# EAGLE design Schematic (EAGLE 9.5.2)
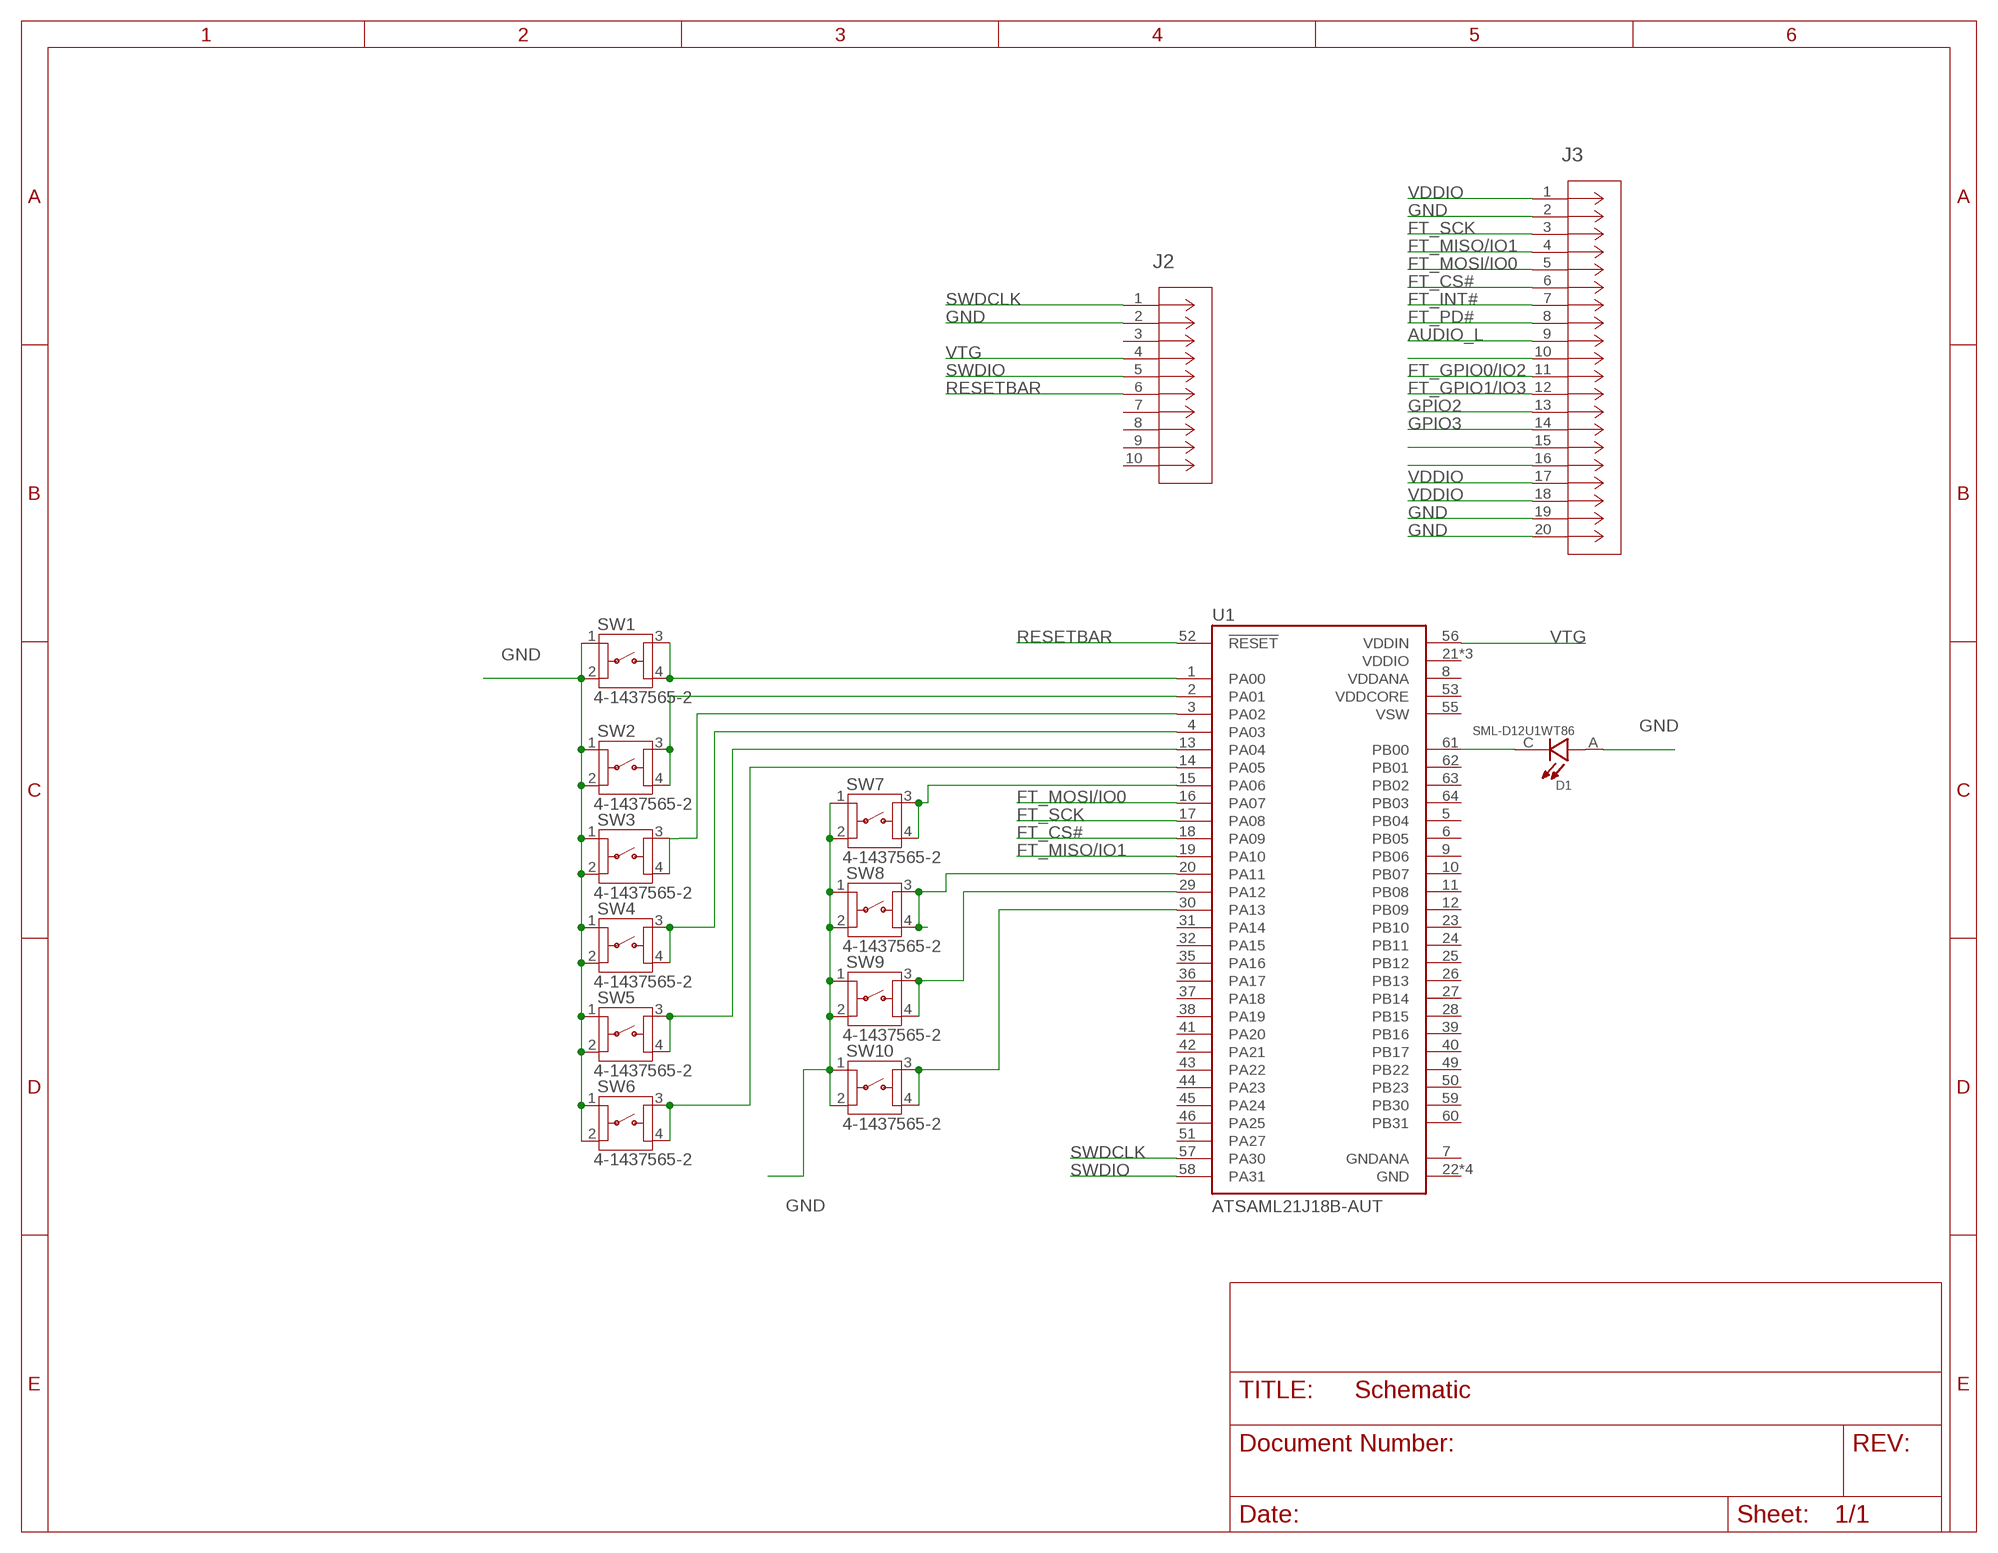
[diagram p0: schematic, sheet 1]

## Parts
D1  SML-D12U1WT86  [LED_SML-D12Y1WT86]
J2  20021121-00010C4LF  [CONN_00010C4LF_AMP]
J3  SBH11-NBPC-D10-SM-BK  [CONN_SBH11-NBPC-D10-SM-BK]
SW1  4-1437565-2  [SW_4-1437565-2]
SW2  4-1437565-2  [SW_4-1437565-2]
SW3  4-1437565-2  [SW_4-1437565-2]
SW4  4-1437565-2  [SW_4-1437565-2]
SW5  4-1437565-2  [SW_4-1437565-2]
SW6  4-1437565-2  [SW_4-1437565-2]
SW7  4-1437565-2  [SW_4-1437565-2]
SW8  4-1437565-2  [SW_4-1437565-2]
SW9  4-1437565-2  [SW_4-1437565-2]
SW10  4-1437565-2  [SW_4-1437565-2]
U1  ATSAML21J18B-AUT  [QFP50P1200X1200X120-64N]

## Nets
AUDIO_L: J3.9
FT_CS#: J3.6 U1.18(PA09)
FT_GPIO0/IO2: J3.11
FT_GPIO1/IO3: J3.12
FT_INT#: J3.7
FT_MISO/IO1: J3.4 U1.19(PA10)
FT_MOSI/IO0: J3.5 U1.16(PA07)
FT_PD#: J3.8
FT_SCK: J3.3 U1.17(PA08)
GND: D1.A J2.2 J3.2 J3.19 J3.20 SW1.1 SW1.2 SW2.1 SW2.2 SW3.1 SW3.2 SW4.1 SW4.2 SW5.1 SW5.2 SW6.1 SW6.2 SW7.1 SW7.2 SW8.1 SW8.2 SW9.1 SW9.2 SW10.1 SW10.2
GPIO2: J3.13
GPIO3: J3.14
N$1: SW1.3 SW1.4 U1.1(PA00)
N$2: SW2.3 SW2.4 U1.2(PA01)
N$3: SW3.3 SW3.4 U1.3(PA02)
N$4: SW4.3 SW4.4 U1.4(PA03)
N$5: SW5.3 SW5.4 U1.13(PA04)
N$6: SW6.3 SW6.4 U1.14(PA05)
N$7: SW7.3 SW7.4 U1.15(PA06)
N$8: SW8.3 SW8.4 U1.20(PA11)
N$9: SW9.3 SW9.4 U1.29(PA12)
N$10: SW10.3 SW10.4 U1.30(PA13)
N$15: D1.C U1.61(PB00)
N$22: J3.10
N$27: J3.15
N$28: J3.16
RESETBAR: J2.6 U1.52(!RESET)
SWDCLK: J2.1 U1.57(PA30)
SWDIO: J2.5 U1.58(PA31)
VDDIO: J3.1 J3.17 J3.18
VTG: J2.4 U1.56(VDDIN)
Unconnected: J2.3 J2.7 J2.8 J2.9 J2.10 U1.5(PB04) U1.6(PB05) U1.9(PB06) U1.10(PB07) U1.11(PB08) U1.12(PB09) U1.23(PB10) U1.24(PB11) U1.25(PB12) U1.26(PB13) U1.27(PB14) U1.28(PB15) U1.31(PA14) U1.32(PA15) U1.35(PA16) U1.36(PA17) U1.37(PA18) U1.38(PA19) U1.39(PB16) U1.40(PB17) U1.41(PA20) U1.42(PA21) U1.43(PA22) U1.44(PA23) U1.45(PA24) U1.46(PA25) U1.49(PB22) U1.50(PB23) U1.51(PA27) U1.59(PB30) U1.60(PB31) U1.62(PB01) U1.63(PB02) U1.64(PB03)

## Power pins joined to a net without a drawn wire
GND: U1.22(GND) U1.33(GND) U1.47(GND) U1.54(GND)
GNDANA: U1.7(GNDANA)
VDDANA: U1.8(VDDANA)
VDDCORE: U1.53(VDDCORE)
VDDIO: U1.21(VDDIO) U1.34(VDDIO) U1.48(VDDIO)
VSW: U1.55(VSW)

## Library data of the parts
D1 = SML-D12U1WT86:SML-D12U1WT86: RED CHIP LED MINI-MOLD; DESCRIPTION: Red 620nm LED Indication - Discrete 2.2V 0603 _1608 Metric_; DIGI-KEY_PART_NUMBER: SML-D12U1WT86CT-ND; DIGI-KEY_PURCHASE_URL: https://www.digikey.com/product-detail/en/rohm-semiconductor/SML-D12U1WT86/SML-D12U1WT86CT-ND/5843858?utm_source=snapeda&utm_medium=aggregator&utm_campaign=symbol; MF: Rohm; MP: SML-D12U1WT86; PACKAGE: 0603 Rohm
J2 = ESE 323 Custom Library:20021121-00010C4LF; BUILT_BY: EMA_Matt; COPYRIGHT: Copyright (C) 2018 Accelerated Designs. All rights reserved; MANUFACTURER_PART_NUMBER: 20021121-00010C4LF; SOURCELIBRARY: Amphenol_2019-10-30; VENDOR: Amphenol
J3 = ESE 323 Custom Library:SBH11-NBPC-D10-SM-BK; BUILT_BY: EMA_Cory; COPYRIGHT: Copyright (C) 2018 Accelerated Designs. All rights reserved; MANUFACTURER_PART_NUMBER: SBH11-NBPC-D10-SM-BK; VENDOR: Sullins
SW1-SW10 = 4-1437565-2:4-1437565-2: Switch Tactile OFF (ON) SPST Round Button Gull Wing 0.05A 12VDC 1.57N SMD T/R; COMMENT: 4-1437565-2; DESCRIPTION: Switch Tactile OFF _ON_ SPST Round Button Gull Wing 0.05A 24VDC 1VA 9.18N SMD T/R; DIGI-KEY_PART_NUMBER: 450-1759-1-ND; DIGI-KEY_PURCHASE_URL: https://www.digikey.com/product-detail/en/te-connectivity-alcoswitch-switches/FSM4JSMATR/450-1759-1-ND/2271638?utm_source=snapeda&utm_medium=aggregator&utm_campaign=symbol; MF: TE Connectivity; MP: FSM4JSMATR; PACKAGE: None; TE_PURCHASE_URL: https://www.te.com/usa-en/product-4-1437565-2.html?te_bu=Cor&te_type=disp&te_campaign=seda_glo_cor-seda-global-disp-prtnr-fy19-seda-model-bom-cta_sma-317_1&elqCampaignId=32493
U1 = ATSAML21J18B-AUT:ATSAML21J18B-AUT: Cortex-MO+, 256KBFLASH, 32 KBSRAM, USB, ULP - 64TQFP 85C, GREEN, 1.6-3.6V, 48MHz/ TQFP (A); DESCRIPTION: ARM® Cortex®-M0+ SAM L21J Microcontroller IC 32-Bit 48MHz 256KB _256K x 8_ FLASH 64-TQFP _10x10_; DIGI-KEY_PART_NUMBER: ATSAML21J18B-AUTCT-ND; DIGI-KEY_PURCHASE_URL: https://www.digikey.com/product-detail/en/microchip-technology/ATSAML21J18B-AUT/ATSAML21J18B-AUTCT-ND/5702316?utm_source=snapeda&utm_medium=aggregator&utm_campaign=symbol; MF: Microchip; MP: ATSAML21J18B-AUT; PACKAGE: TQFP-64 Microchip

## Board
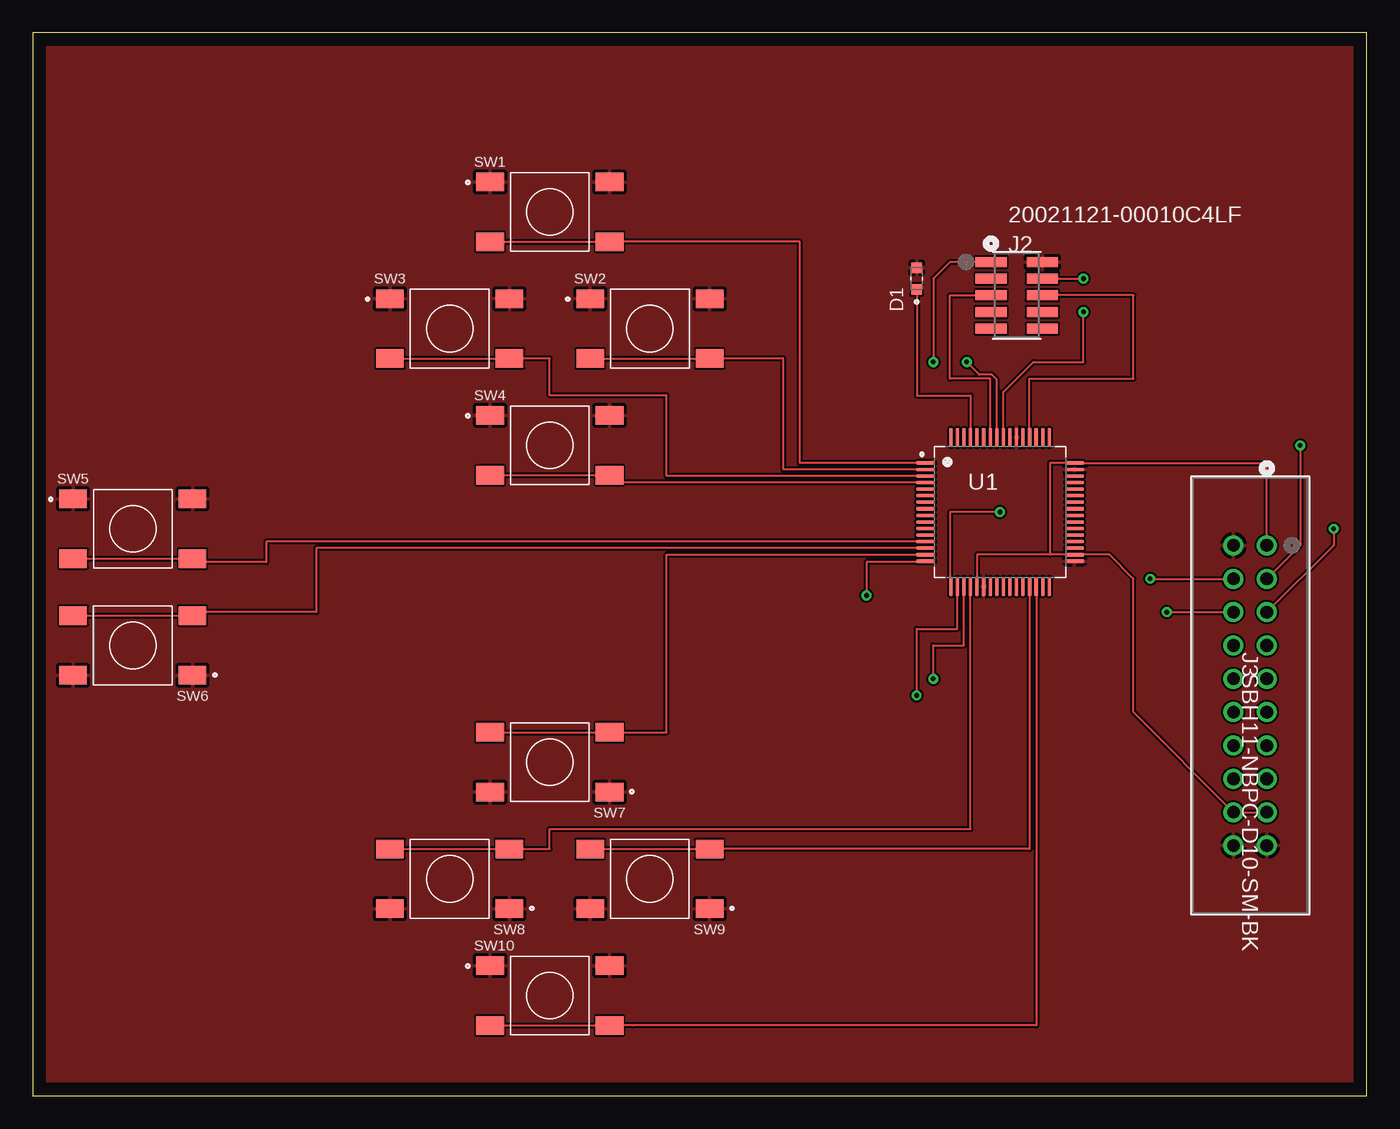
[diagram p1: board, top side]
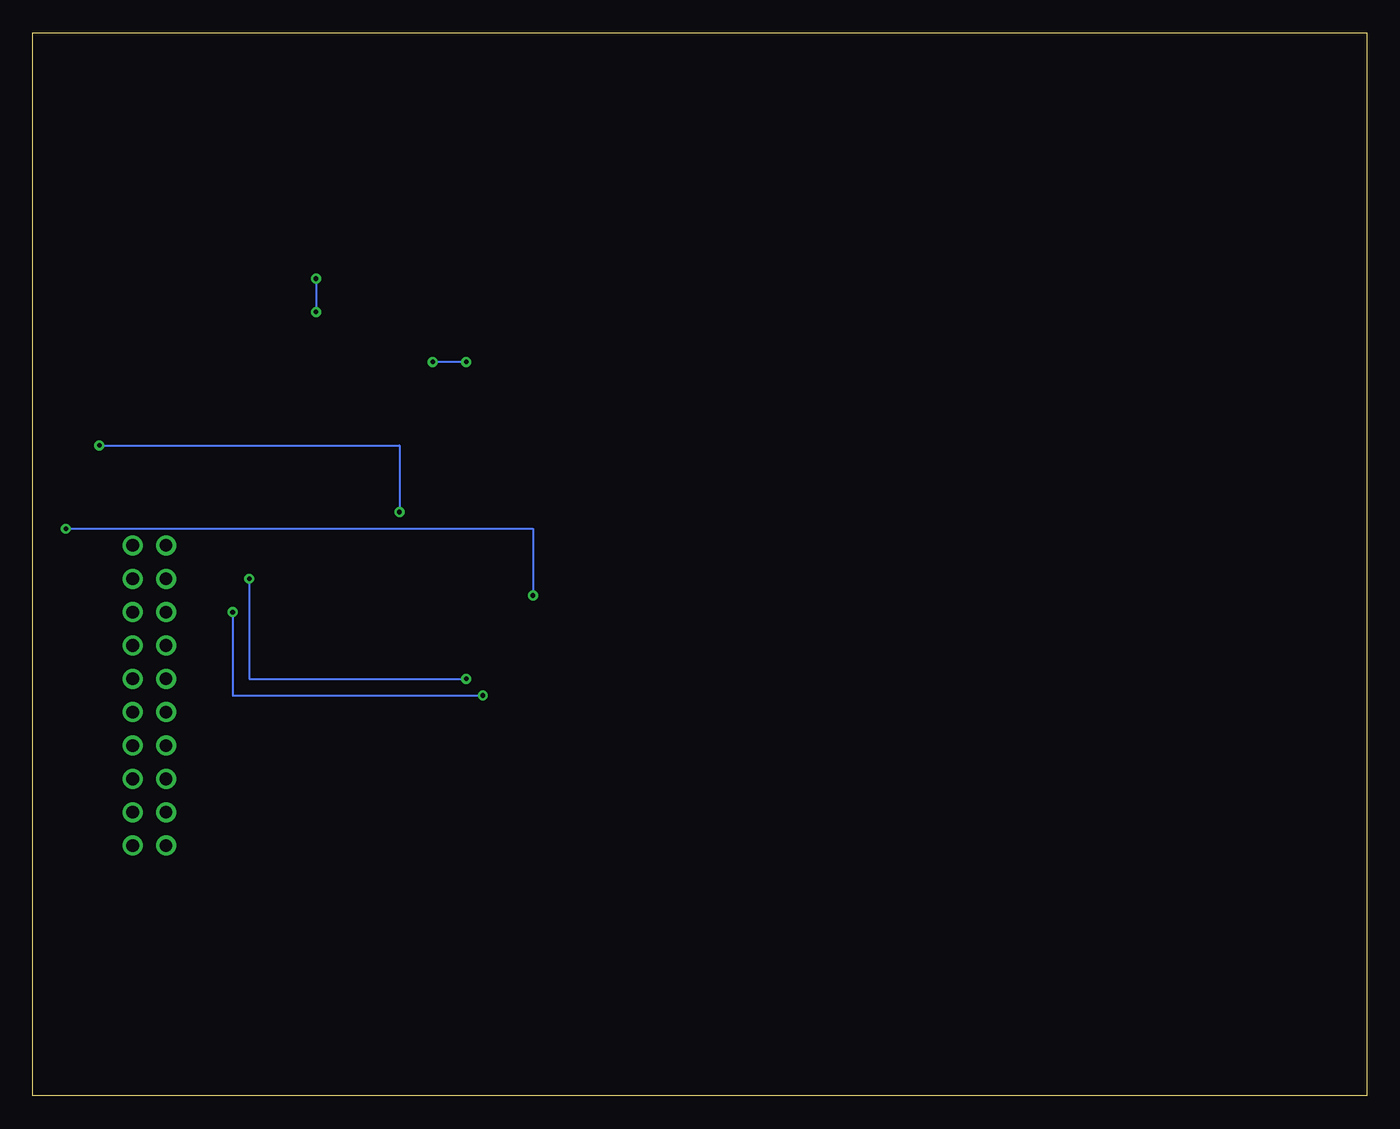
[diagram p2: board, bottom side, seen from below]

Size 101.58 x 80.95 mm. Coordinates in mm from the lower left corner, seen from the top.
Outline: 0,0 101.58,0 101.58,80.95 0,80.95 0,0
Copper layers (1*16): Top 0.035mm / dielectric 1.5mm / Bottom 0.035mm
Design rules "default": minimum track width 6mil, minimum drill 0.35mm, track to track 6mil, track to pad 6mil, pad to pad 6mil, via to via 6mil, smd to smd 6mil, copper to edge 40mil, drill to drill 6mil, minimum pad ring 10mil, minimum via ring 8mil, stop-mask expansion 4mil, vias tented up to drill 0mil, thermal gap 10mil

### Footprints (pad centres in the part's own frame; a part is rotated, then mirrored left to right if it is on the bottom)
LED_SML-D12Y1WT86 = smd 0.8 x 0.8: A 0.825,0; C -0.825,0
CONN_00010C4LF_AMP = smd 0.762 x 2.388: 1 -2.54,-1.95; 2 -2.54,1.95; 3 -1.27,-1.95; 4 -1.27,1.95; 5 0,-1.95; 6 0,1.95; 7 1.27,-1.95; 8 1.27,1.95; 9 2.54,-1.95; 10 2.54,1.95
CONN_SBH11-NBPC-D10-SM-BK = drill 0.965 pad 1.524: 1 -11.43,1.27; 2 -11.43,-1.27; 3 -8.89,1.27; 4 -8.89,-1.27; 5 -6.35,1.27; 6 -6.35,-1.27; 7 -3.81,1.27; 8 -3.81,-1.27; 9 -1.27,1.27; 10 -1.27,-1.27; 11 1.27,1.27; 12 1.27,-1.27; 13 3.81,1.27; 14 3.81,-1.27; 15 6.35,1.27; 16 6.35,-1.27; 17 8.89,1.27; 18 8.89,-1.27; 19 11.43,1.27; 20 11.43,-1.27
SW_4-1437565-2 = smd 2.1 x 1.4: 1 -4.55,2.275; 2 4.55,2.275; 3 -4.55,-2.275; 4 4.55,-2.275
QFP50P1200X1200X120-64N = smd 1.47 x 0.28: 1 -5.67,3.75; 2 -5.67,3.25; 3 -5.67,2.75; 4 -5.67,2.25; 5 -5.67,1.75; 6 -5.67,1.25; 7 -5.67,0.75; 8 -5.67,0.25; 9 -5.67,-0.25; 10 -5.67,-0.75; 11 -5.67,-1.25; 12 -5.67,-1.75; 13 -5.67,-2.25; 14 -5.67,-2.75; 15 -5.67,-3.25; 16 -5.67,-3.75; 33 5.67,-3.75; 34 5.67,-3.25; 35 5.67,-2.75; 36 5.67,-2.25; 37 5.67,-1.75; 38 5.67,-1.25; 39 5.67,-0.75; 40 5.67,-0.25; 41 5.67,0.25; 42 5.67,0.75; 43 5.67,1.25; 44 5.67,1.75; 45 5.67,2.25; 46 5.67,2.75; 47 5.67,3.25; 48 5.67,3.75 | smd 0.28 x 1.47: 17 -3.75,-5.67; 18 -3.25,-5.67; 19 -2.75,-5.67; 20 -2.25,-5.67; 21 -1.75,-5.67; 22 -1.25,-5.67; 23 -0.75,-5.67; 24 -0.25,-5.67; 25 0.25,-5.67; 26 0.75,-5.67; 27 1.25,-5.67; 28 1.75,-5.67; 29 2.25,-5.67; 30 2.75,-5.67; 31 3.25,-5.67; 32 3.75,-5.67; 49 3.75,5.67; 50 3.25,5.67; 51 2.75,5.67; 52 2.25,5.67; 53 1.75,5.67; 54 1.25,5.67; 55 0.75,5.67; 56 0.25,5.67; 57 -0.25,5.67; 58 -0.75,5.67; 59 -1.25,5.67; 60 -1.75,5.67; 61 -2.25,5.67; 62 -2.75,5.67; 63 -3.25,5.67; 64 -3.75,5.67

### Placement (x,y rotation side)
D1  67.31,62.23 90 top
J2  74.93,60.96 270 top
J3  92.71,30.48 270 top
SW1  39.37,67.31 0 top
SW2  46.99,58.42 0 top
SW3  31.75,58.42 0 top
SW4  39.37,49.53 0 top
SW5  7.62,43.18 0 top
SW6  7.62,34.29 180 top
SW7  39.37,25.4 180 top
SW8  31.75,16.51 180 top
SW9  46.99,16.51 180 top
SW10  39.37,7.62 0 top
U1  73.66,44.45 0 top

### Tracks (layer width: path | path; a pad name or v marks a point on that pad's centre or on a via)
FT_CS#  (via drill 0.35)
  Top 0.152: v86.36,36.83 J3.6 | v67.31,30.48 67.31,35.56 70.41,35.56 U1.18
  Bottom 0.152: v86.36,36.83 86.36,30.48 v67.31,30.48
FT_MISO/IO1  (via drill 0.35)
  Top 0.152: v85.09,39.37 J3.4 | v68.58,31.75 68.58,34.29 70.91,34.29 U1.19
  Bottom 0.152: v85.09,39.37 85.09,31.75 v68.58,31.75
FT_MOSI/IO0  (via drill 0.35)
  Top 0.152: v99.06,43.18 99.06,41.91 J3.5 | U1.16 67.99,40.64 63.5,40.64 v63.5,38.1
  Bottom 0.152: v99.06,43.18 63.5,43.18 v63.5,38.1
FT_SCK  (via drill 0.35)
  Top 0.152: v96.52,49.53 96.52,41.91 J3.3 | v73.66,44.45 69.85,44.45 69.85,38.78 U1.17
  Bottom 0.152: v96.52,49.53 73.66,49.53 v73.66,44.45
GND
  pour Top: 0,0 0,81.28 101.6,81.28 101.6,0
N$1
  Top 0.152: U1.1 58.42,48.2 58.42,65.03 44.45,65.03 SW1.4 SW1.3
N$2
  Top 0.152: U1.2 57.15,47.7 57.15,56.14 52.07,56.14 SW2.4 SW2.3
N$3
  Top 0.152: U1.3 48.26,47.2 48.26,53.34 39.37,53.34 39.37,56.14 36.83,56.14 SW3.4 SW3.3
N$4
  Top 0.152: U1.4 43.92,46.7 SW4.4 SW4.3
N$5
  Top 0.152: U1.13 17.78,42.2 17.78,40.64 12.17,40.64 | 12.17,40.64 SW5.4 | SW5.3 11.9,40.91 12.17,40.64
N$6
  Top 0.152: U1.14 21.59,41.7 21.59,36.83 12.17,36.83 SW6.3 SW6.4
N$7
  Top 0.152: U1.15 48.26,41.2 48.26,27.68 SW7.3 SW7.4
N$8
  Top 0.152: U1.20 71.41,20.32 39.37,20.32 39.37,18.79 36.83,18.79 SW8.3 SW8.4
N$9
  Top 0.152: U1.29 75.91,18.79 52.07,18.79 SW9.3 SW9.4
N$10
  Top 0.152: U1.30 76.41,5.34 45.72,5.34 SW10.4 SW10.3
N$15
  Top 0.152: D1.C 67.31,53.34 71.41,53.34 U1.61
RESETBAR
  Top 0.152: U1.52 75.91,54.61 83.82,54.61 83.82,60.96 J2.6
SWDCLK  (via drill 0.35)
  Top 0.152: v71.12,55.88 72.08,54.92 73.04,54.92 73.41,54.54 U1.57 | J2.1 69.85,63.5 68.58,62.23 v68.58,55.88
  Bottom 0.152: v68.58,55.88 v71.12,55.88
SWDIO
  Top 0.152: U1.58 72.91,54.61 69.85,54.61 69.85,60.96 J2.5
VDDIO
  Top 0.152: J3.17 J3.18 83.82,29.21 83.82,39.37 81.99,41.2 U1.34 77.47,41.2 | 77.47,41.2 71.91,41.2 U1.21 | 77.47,41.2 77.47,48.2 U1.48 94,48.2 93.98,48.19 J3.1
VTG  (via drill 0.35)
  Top 0.152: U1.56 73.91,53.59 76.2,55.88 80.01,55.88 v80.01,59.69 | J2.4 v80.01,62.23
  Bottom 0.152: v80.01,62.23 v80.01,59.69